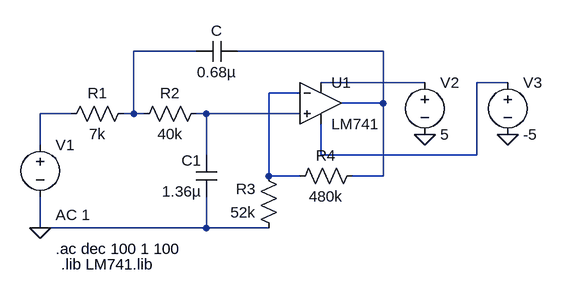
[diagram p0: schematic ButtersWorth.asc]
ButtersWorth.asc, the LTspice schematic file:
Version 4
SHEET 1 880 680
WIRE 240 16 144 16
WIRE 528 16 304 16
WIRE 592 64 432 64
WIRE 720 64 672 64
WIRE 400 80 352 80
WIRE 528 96 528 16
WIRE 528 96 464 96
WIRE 48 112 0 112
WIRE 144 112 144 16
WIRE 144 112 128 112
WIRE 160 112 144 112
WIRE 256 112 240 112
WIRE 400 112 256 112
WIRE 0 160 0 112
WIRE 256 176 256 112
WIRE 432 176 432 128
WIRE 672 176 672 64
WIRE 672 176 432 176
WIRE 352 208 352 80
WIRE 400 208 352 208
WIRE 528 208 528 96
WIRE 528 208 480 208
WIRE 0 288 0 240
WIRE 256 288 256 240
WIRE 256 288 0 288
WIRE 352 288 256 288
FLAG 0 288 0
FLAG 592 144 0
FLAG 720 144 0
SYMBOL res 144 96 R90
WINDOW 0 0 56 VBottom 2
WINDOW 3 32 56 VTop 2
SYMATTR InstName R1
SYMATTR Value 7k
SYMBOL res 256 96 R90
WINDOW 0 0 56 VBottom 2
WINDOW 3 32 56 VTop 2
SYMATTR InstName R2
SYMATTR Value 40k
SYMBOL cap 304 0 R90
WINDOW 0 0 32 VBottom 2
WINDOW 3 32 32 VTop 2
SYMATTR InstName C
SYMATTR Value 0.68µ
SYMBOL cap 272 240 R180
WINDOW 0 24 56 Left 2
WINDOW 3 24 8 Left 2
SYMATTR InstName C1
SYMATTR Value 1.36µ
SYMBOL OpAmps\\LM741 432 32 R0
SYMATTR InstName U1
SYMBOL res 496 192 R90
WINDOW 0 0 56 VBottom 2
WINDOW 3 32 56 VTop 2
SYMATTR InstName R4
SYMATTR Value 480k
SYMBOL res 368 304 R180
WINDOW 0 36 76 Left 2
WINDOW 3 36 40 Left 2
SYMATTR InstName R3
SYMATTR Value 52k
SYMBOL voltage 0 144 R0
WINDOW 123 24 124 Left 2
WINDOW 39 0 0 Left 0
SYMATTR Value2 AC 1
SYMATTR InstName V1
SYMATTR Value ""
SYMBOL voltage 592 48 R0
WINDOW 123 0 0 Left 0
WINDOW 39 0 0 Left 0
SYMATTR InstName V2
SYMATTR Value 5
SYMBOL voltage 720 48 R0
WINDOW 123 0 0 Left 0
WINDOW 39 0 0 Left 0
SYMATTR InstName V3
SYMATTR Value -5
TEXT 24 320 Left 2 !.ac dec 100 1 100
TEXT 32 344 Left 2 !.lib LM741.lib

The netlist it stands for:
* ButtersWorth.asc
R1 N001 N006 7k
R2 N007 N001 40k
C N002 N001 0.68µ
C1 0 N007 1.36µ
XU1 N007 N005 N003 N004 N002 LM741  ; pins In+ In- V+ V- OUT
R4 N002 N005 480k
R3 0 N005 52k
V1 N006 0 AC 1
V2 N003 0 5
V3 N004 0 -5
.ac dec 100 1 100
.lib LM741.lib
.lib LM741.lib
.backanno
.end